# EAGLE schematic tactile (EAGLE 9.6.2)
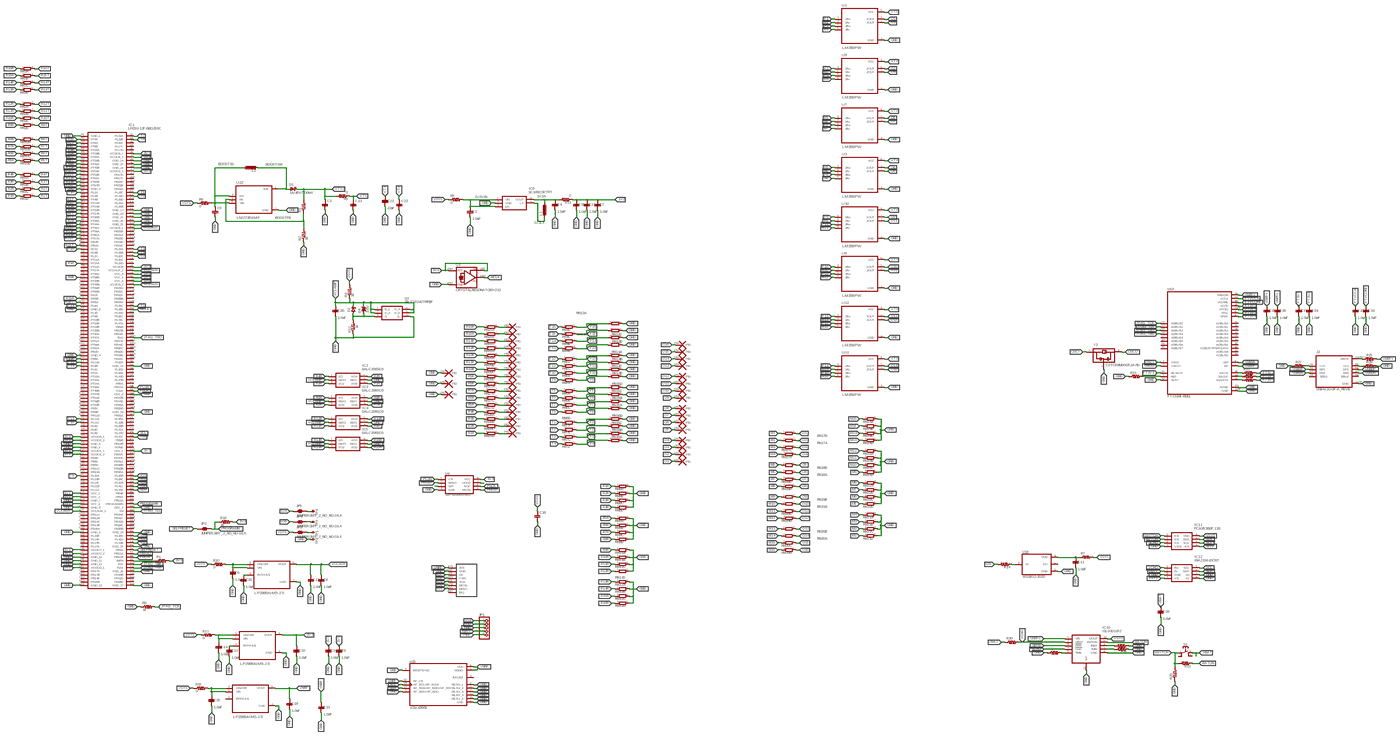
[diagram p0: schematic, sheet 1, overview]
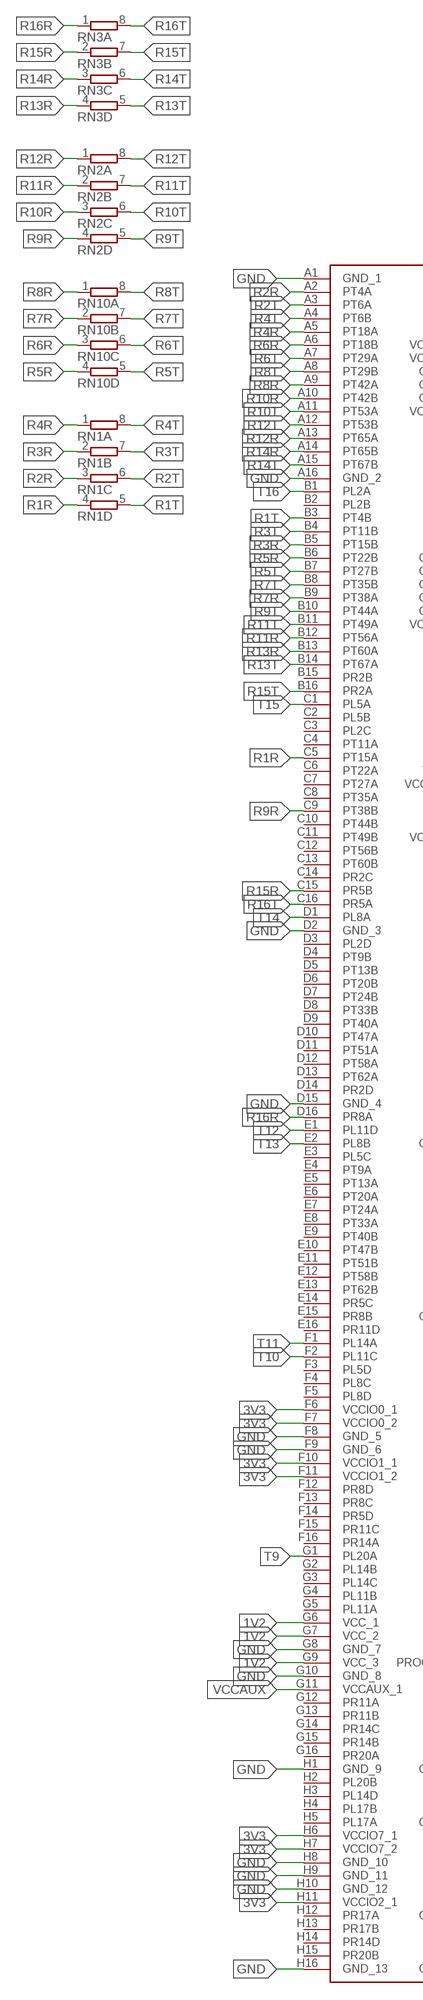
[diagram p1: schematic, sheet 1, part 1 of 4]
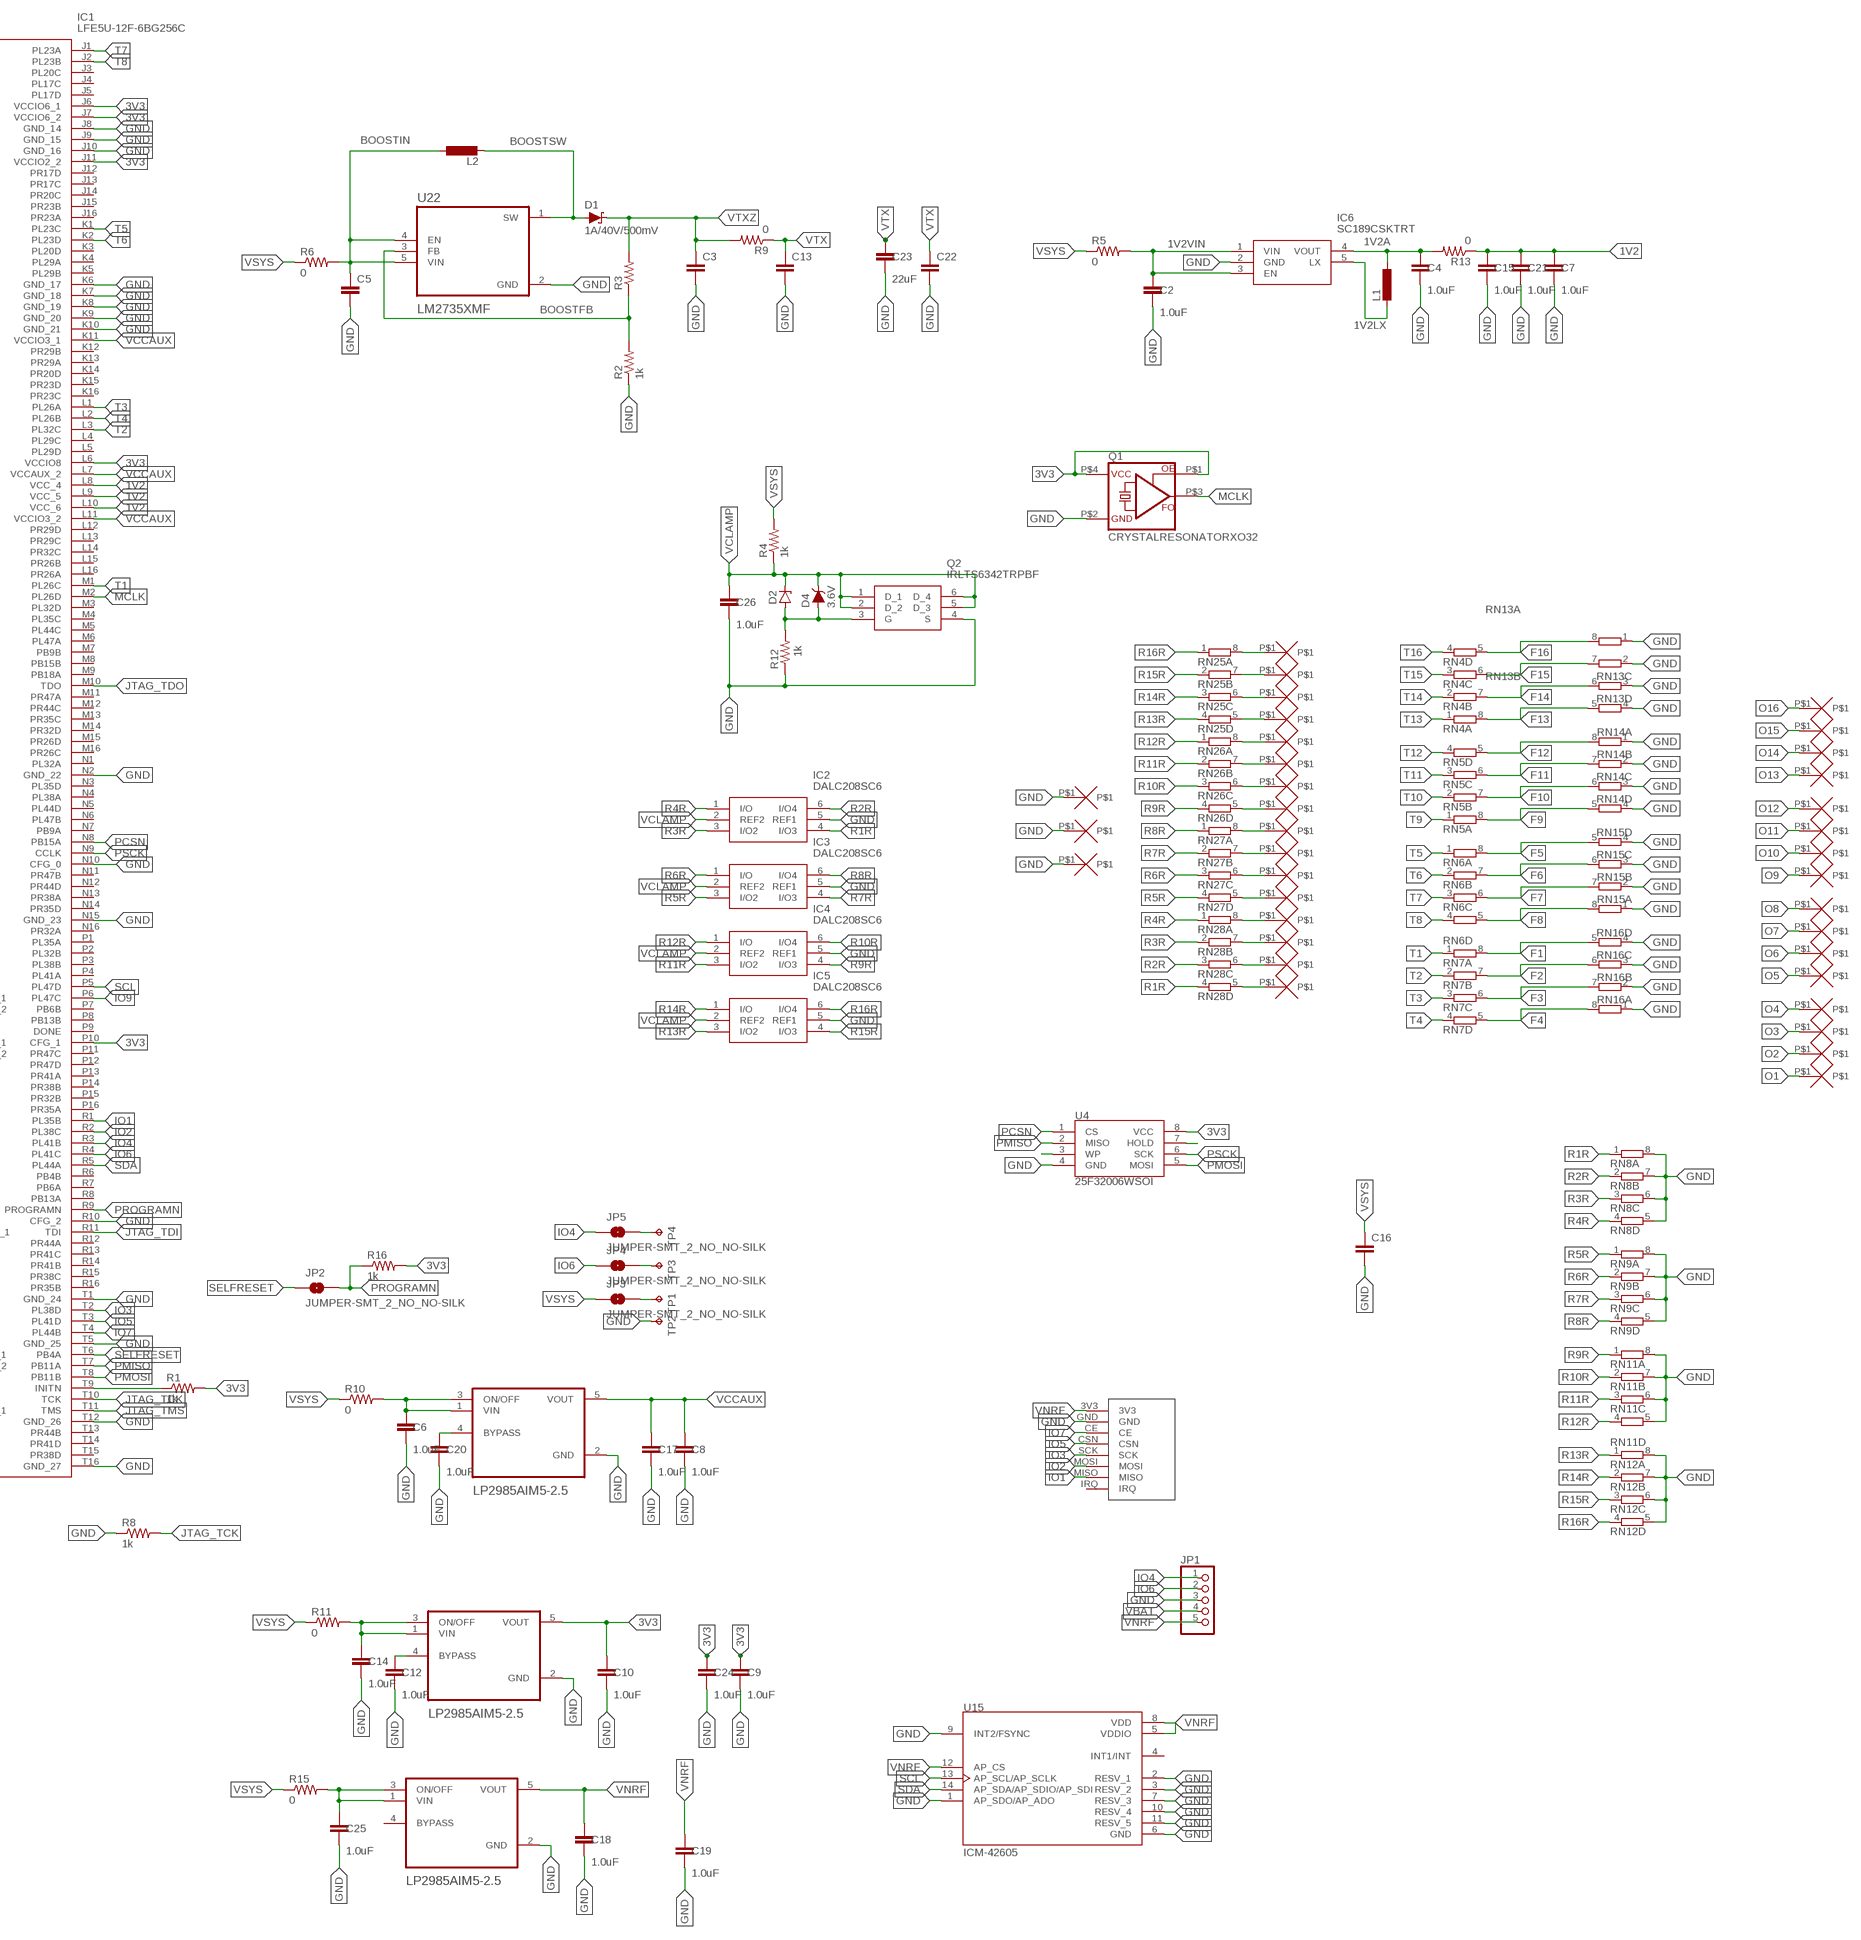
[diagram p2: schematic, sheet 1, part 2 of 4]
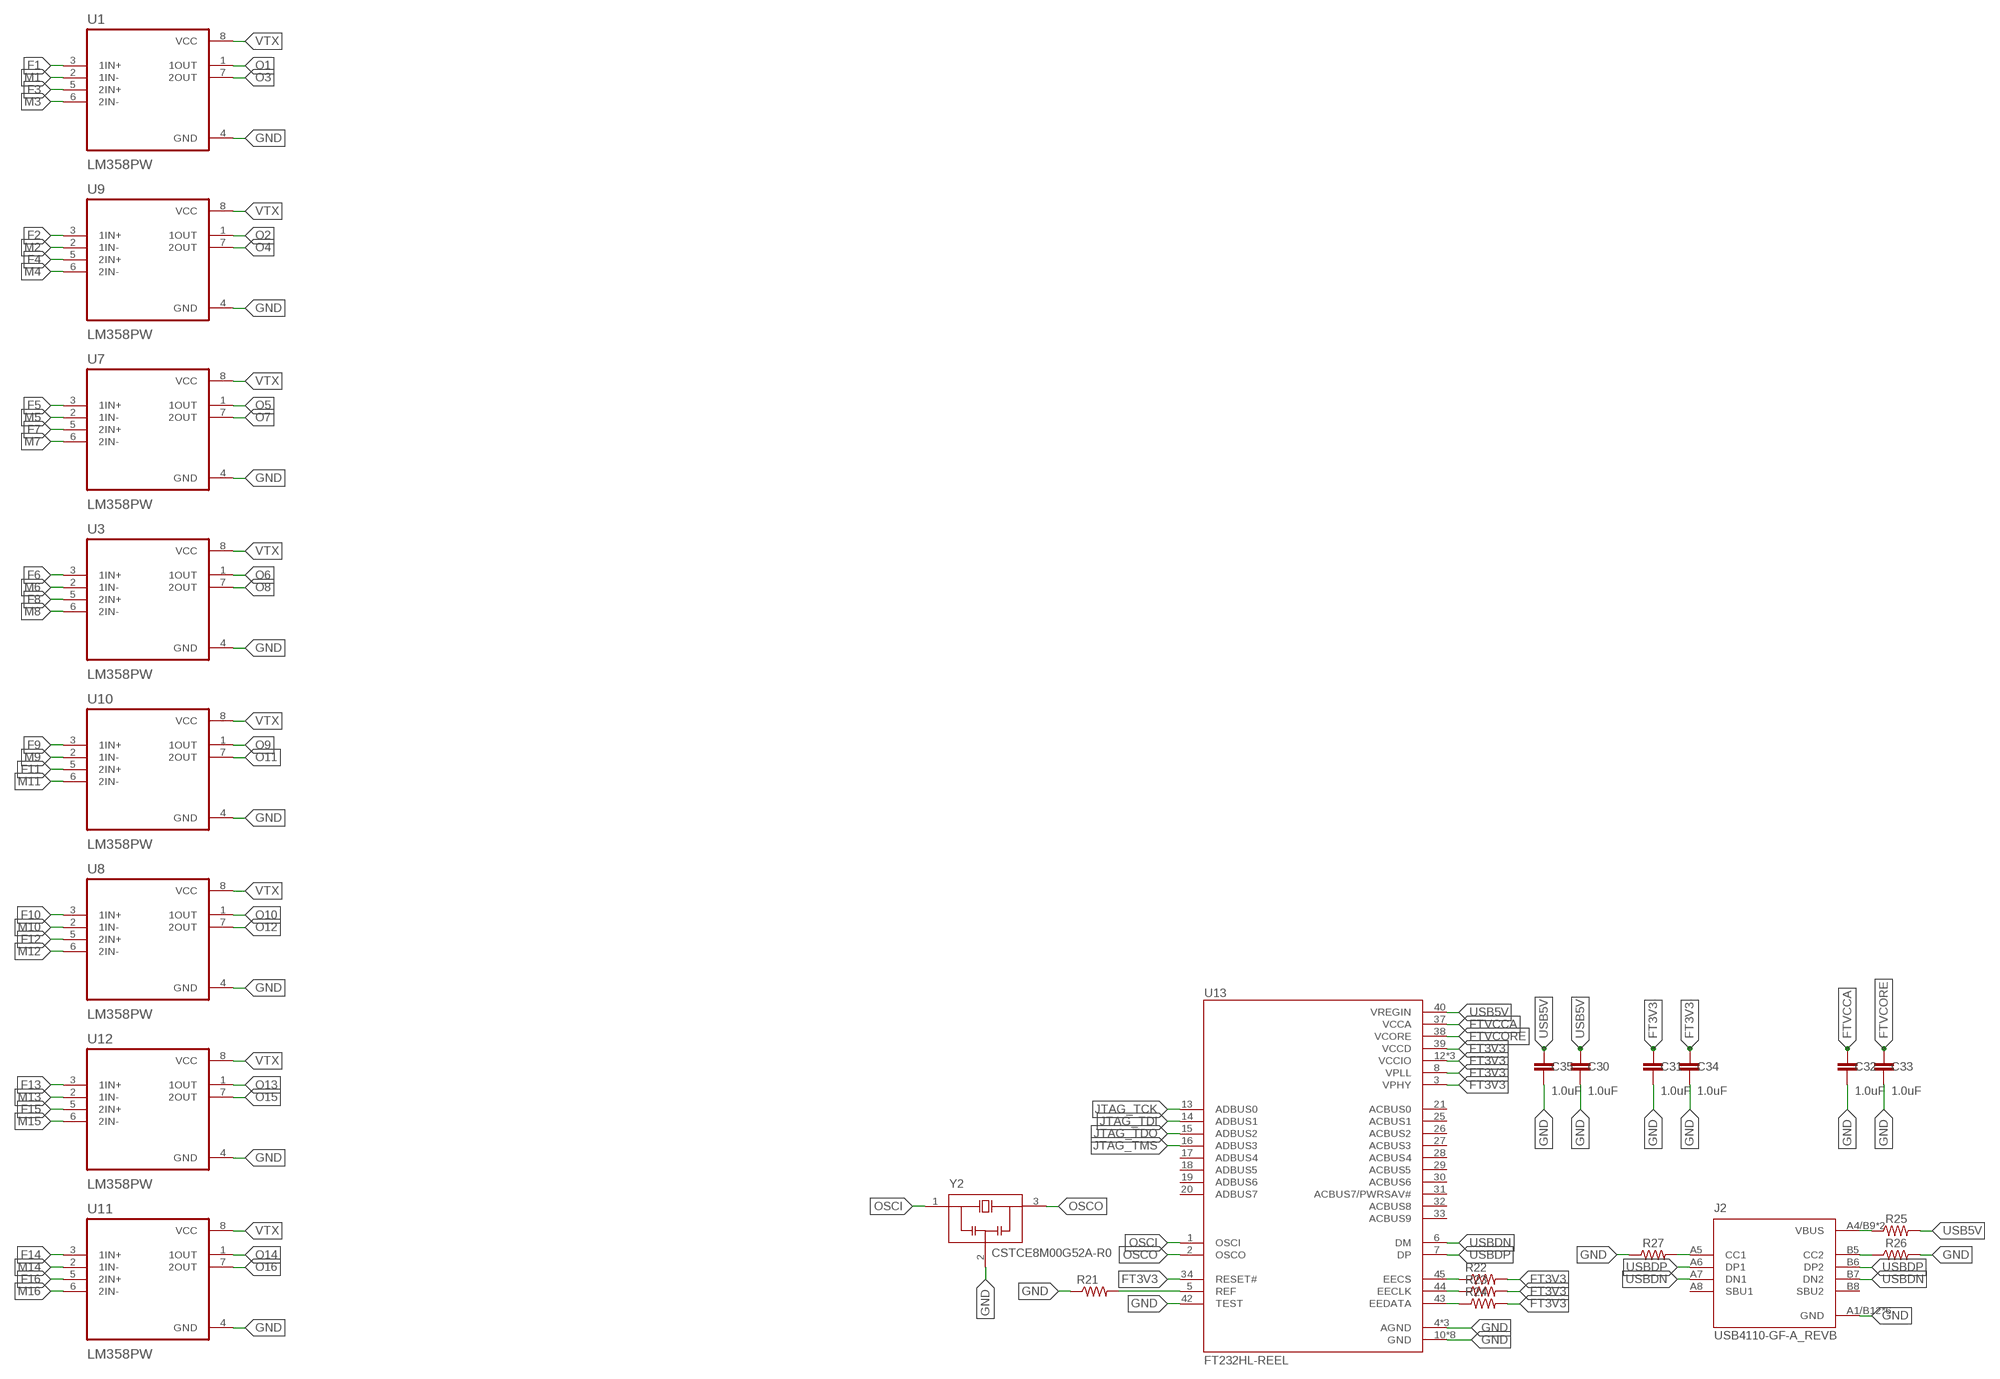
[diagram p3: schematic, sheet 1, part 3 of 4]
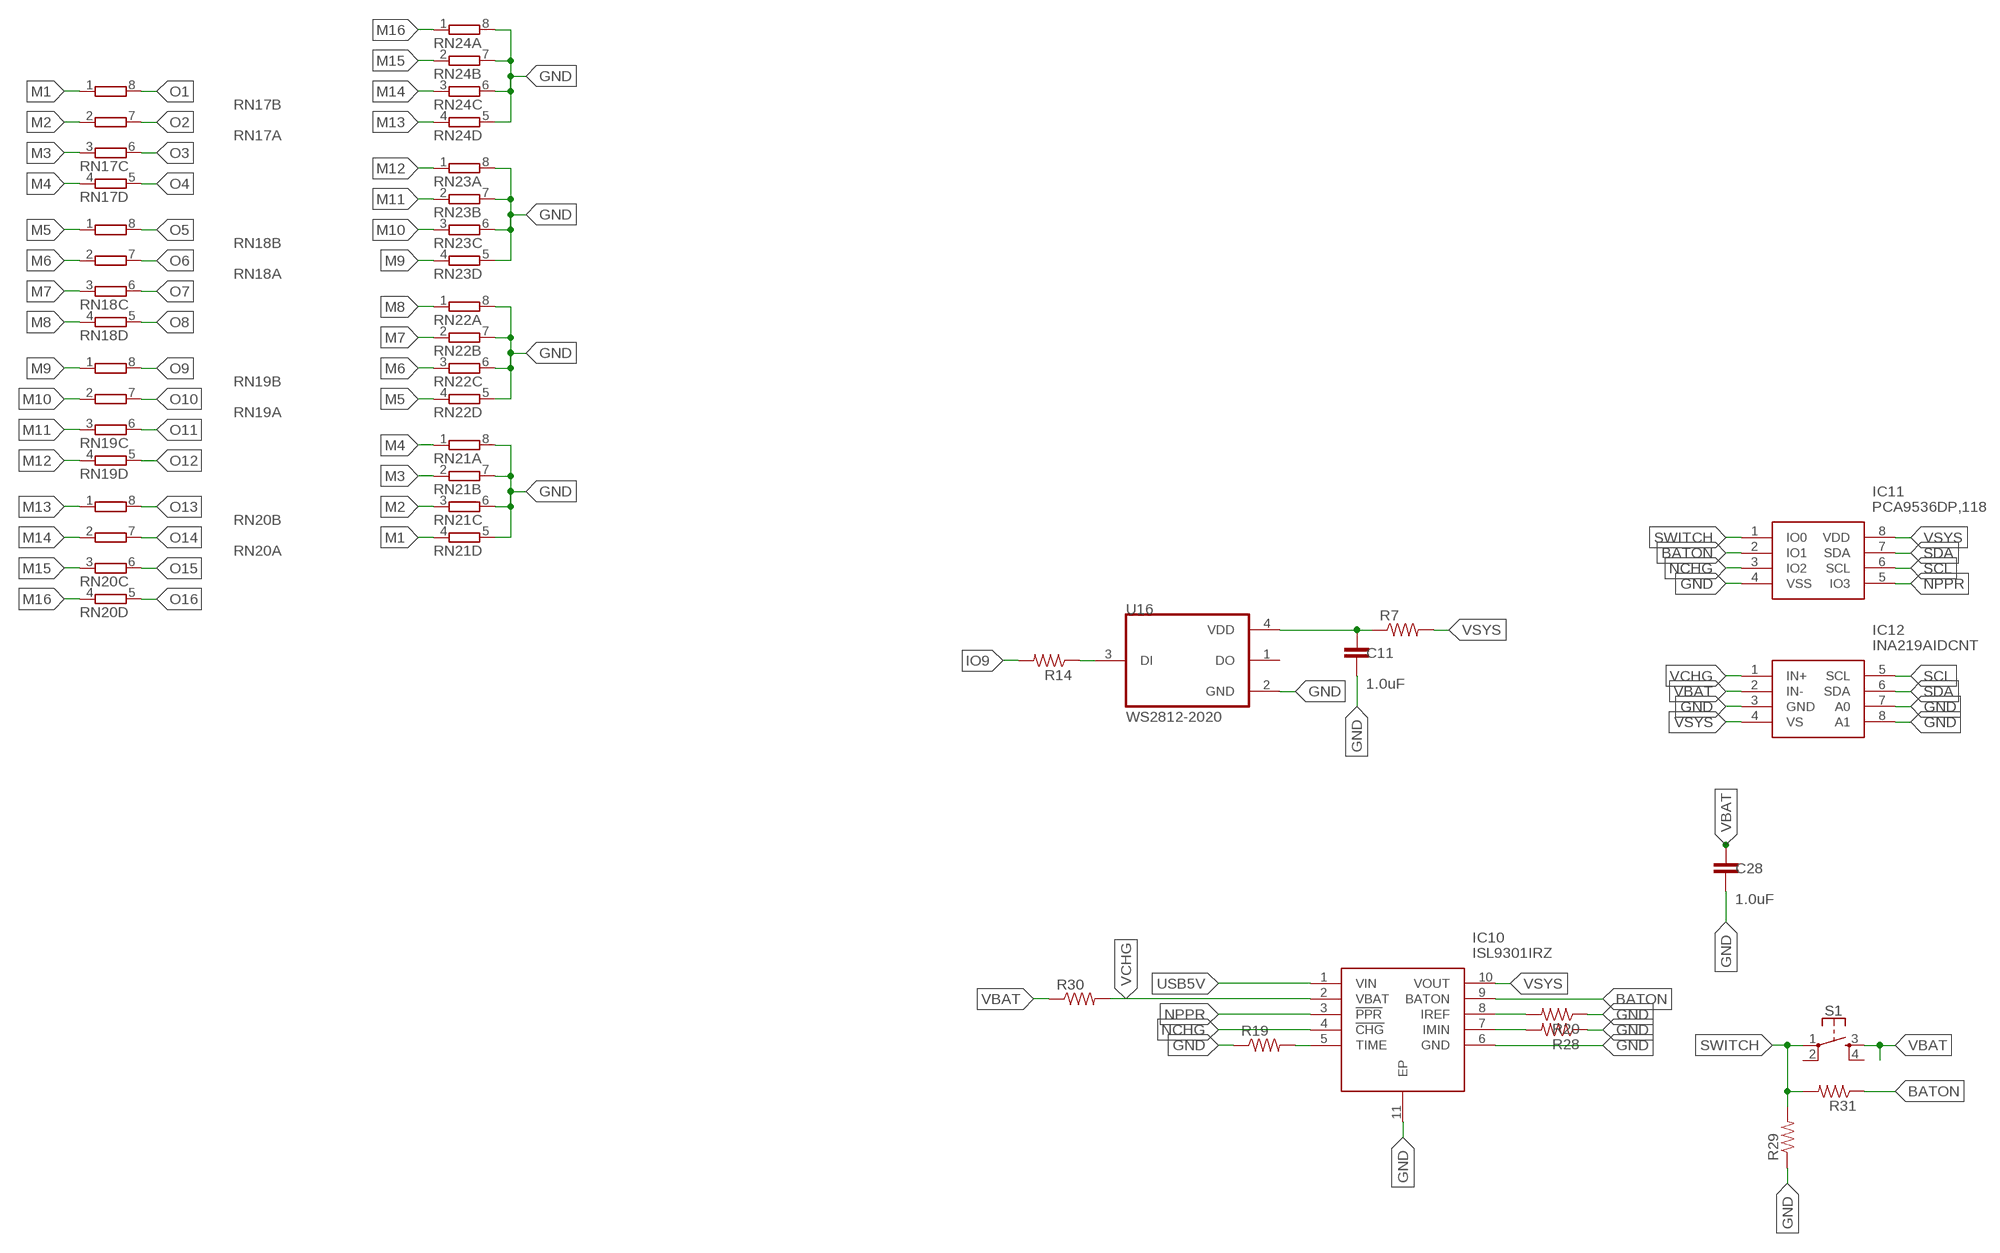
[diagram p4: schematic, sheet 1, part 4 of 4]

## Parts
C2  1.0uF  1.0UF-0603-16V-10%  [0603]
C3  C-EUC0805  [C0805]
C4  1.0uF  1.0UF-0603-16V-10%  [0603]
C5  C-EUC0805  [C0805]
C6  1.0uF  1.0UF-0603-16V-10%  [0603]
C7  1.0uF  1.0UF-0603-16V-10%  [0603]
C8  1.0uF  1.0UF-0603-16V-10%  [0603]
C9  1.0uF  1.0UF-0603-16V-10%  [0603]
C10  1.0uF  1.0UF-0603-16V-10%  [0603]
C11  1.0uF  1.0UF-0603-16V-10%  [0603]
C12  1.0uF  1.0UF-0603-16V-10%  [0603]
C13  C-EUC0805  [C0805]
C14  1.0uF  1.0UF-0603-16V-10%  [0603]
C15  1.0uF  1.0UF-0603-16V-10%  [0603]
C16  C-EUC1812  [C1812]
C17  1.0uF  1.0UF-0603-16V-10%  [0603]
C18  1.0uF  1.0UF-0603-16V-10%  [0603]
C19  1.0uF  1.0UF-0603-16V-10%  [0603]
C20  1.0uF  1.0UF-0603-16V-10%  [0603]
C21  1.0uF  1.0UF-0603-16V-10%  [0603]
C22  C-EUC0805  [C0805]
C23  22uF  22UF-0805-16V-20%  [0805]
C24  1.0uF  1.0UF-0603-16V-10%  [0603]
C25  1.0uF  1.0UF-0603-16V-10%  [0603]
C26  1.0uF  1.0UF-0603-16V-10%  [0603]
C28  1.0uF  1.0UF-0603-16V-10%  [0603]
C30  1.0uF  1.0UF-1206-50V-10%  [1206]
C31  1.0uF  1.0UF-0603-16V-10%  [0603]
C32  1.0uF  1.0UF-0603-16V-10%  [0603]
C33  1.0uF  1.0UF-0603-16V-10%  [0603]
C34  1.0uF  1.0UF-0603-16V-10%  [0603]
C35  1.0uF  1.0UF-0603-16V-10%  [0603]
D1  1A/40V/500mV  DIODE-SCHOTTKY-SS14  [SMA-DIODE]
D2  ZENER-DIODESOT23  [SOT23]
D4  3.6V  DIODE-ZENER-BZT52C3V6S  [SOD-323]
IC1  LFE5U-12F-6BG256C  [BGA256C80P16X16_1400X1400X170]
IC2  DALC208SC6  [SOT95P280X145-6N]
IC3  DALC208SC6  [SOT95P280X145-6N]
IC4  DALC208SC6  [SOT95P280X145-6N]
IC5  DALC208SC6  [SOT95P280X145-6N]
IC6  SC189CSKTRT  [SOT95P280X145-5N]
IC10  ISL9301IRZ  [SON50P300X300X90-11N]
IC11  PCA9536DP,118  [SOP65P490X110-8N]
IC12  INA219AIDCNT  [SOT65P280X145-8N]
J2  USB4110-GF-A_REVB  [GCT_USB4110-GF-A_REVB]
JP1  PINHD-1X5M  [1X05M]
JP2  JUMPER-SMT_2_NO_NO-SILK  [SMT-JUMPER_2_NO_NO-SILK]
JP3  JUMPER-SMT_2_NO_NO-SILK  [SMT-JUMPER_2_NO_NO-SILK]
JP4  JUMPER-SMT_2_NO_NO-SILK  [SMT-JUMPER_2_NO_NO-SILK]
JP5  JUMPER-SMT_2_NO_NO-SILK  [SMT-JUMPER_2_NO_NO-SILK]
L1  L-EUL3230M  [L3230M]
L2  L-EUL3225P  [L3225P]
Q1  CRYSTALRESONATORXO32  [XO32]
Q2  IRLTS6342TRPBF  [SOT95P280X145-6N]
R1  1k  1KOHM-0603-1/10W-1%  [0603]
R2  1k  1KOHM-0603-1/10W-1%  [0603]
R3  1k  1KOHM-0603-1/10W-1%  [0603]
R4  1k  1KOHM-0603-1/10W-1%  [0603]
R5  0  0OHM-0603-1/10W  [0603]
R6  0  0OHM-0603-1/10W  [0603]
R7  RESISTOR0603  [0603]
R8  1k  1KOHM-0603-1/10W-1%  [0603]
R9  0  0OHM-0603-1/10W  [0603]
R10  0  0OHM-0603-1/10W  [0603]
R11  0  0OHM-0603-1/10W  [0603]
R12  1k  1KOHM-0603-1/10W-1%  [0603]
R13  0  0OHM-0603-1/10W  [0603]
R14  RESISTOR0603  [0603]
R15  0  0OHM-0603-1/10W  [0603]
R16  1k  1KOHM-0603-1/10W-1%  [0603]
R19  RESISTOR0603  [0603]
R20  RESISTOR0603  [0603]
R21  RESISTOR0603  [0603]
R22  RESISTOR0603  [0603]
R23  RESISTOR0603  [0603]
R24  RESISTOR0603  [0603]
R25  RESISTOR0603  [0603]
R26  RESISTOR0603  [0603]
R27  RESISTOR0603  [0603]
R28  RESISTOR0603  [0603]
R29  RESISTOR0603  [0603]
R30  RESISTOR0603  [0603]
R31  RESISTOR0603  [0603]
RN1  4R-NEXBV8V  [EXBV8V]
RN2  4R-NEXBV8V  [EXBV8V]
RN3  4R-NEXBV8V  [EXBV8V]
RN4  4R-NEXBV8V  [EXBV8V]
RN5  4R-NEXBV8V  [EXBV8V]
RN6  4R-NEXBV8V  [EXBV8V]
RN7  4R-NEXBV8V  [EXBV8V]
RN8  4R-NEXBV8V  [EXBV8V]
RN9  4R-NEXBV8V  [EXBV8V]
RN10  4R-NEXBV8V  [EXBV8V]
RN11  4R-NEXBV8V  [EXBV8V]
RN12  4R-NEXBV8V  [EXBV8V]
RN13  4R-NEXBV8V  [EXBV8V]
RN14  4R-NEXBV8V  [EXBV8V]
RN15  4R-NEXBV8V  [EXBV8V]
RN16  4R-NEXBV8V  [EXBV8V]
RN17  4R-NEXBV8V  [EXBV8V]
RN18  4R-NEXBV8V  [EXBV8V]
RN19  4R-NEXBV8V  [EXBV8V]
RN20  4R-NEXBV8V  [EXBV8V]
RN21  4R-NEXBV8V  [EXBV8V]
RN22  4R-NEXBV8V  [EXBV8V]
RN23  4R-NEXBV8V  [EXBV8V]
RN24  4R-NEXBV8V  [EXBV8V]
RN25  4R-NEXBV8V  [EXBV8V]
RN26  4R-NEXBV8V  [EXBV8V]
RN27  4R-NEXBV8V  [EXBV8V]
RN28  4R-NEXBV8V  [EXBV8V]
S1  MOMENTARY-SWITCH-SPST-2-SMD-5.2MM  [TACTILE_SWITCH_SMD_5.2MM]
TP1  TPTP12SQ  [TP12SQ]
TP2  TPTP12SQ  [TP12SQ]
TP3  TPTP12SQ  [TP12SQ]
TP4  TPTP12SQ  [TP12SQ]
U1  LM358PW  [SOP65P640X120-8N]
U3  LM358PW  [SOP65P640X120-8N]
U4  25F32006WSOI  SPI_FLASH-X25XXSMD1  [SO08-EIAJ]
U5  LP2985AIM5-2.5  [SOT95P280X145-5N]
U6  LP2985AIM5-2.5  [SOT95P280X145-5N]
U7  LM358PW  [SOP65P640X120-8N]
U8  LM358PW  [SOP65P640X120-8N]
U9  LM358PW  [SOP65P640X120-8N]
U10  LM358PW  [SOP65P640X120-8N]
U11  LM358PW  [SOP65P640X120-8N]
U12  LM358PW  [SOP65P640X120-8N]
U13  FT232HL-REEL  [QFP50P900X900X160-48N]
U14  LP2985AIM5-2.5  [SOT95P280X145-5N]
U15  ICM-42605  [PQFN50P300X250X97-14N]
U16  WS2812-2020  [LED_WS2812-2020]
U22  LM2735XMF  [SOT95P280X145-5N]
U$1  PADPAD3X05  [PAD3X05]
U$2  PADPAD3X05  [PAD3X05]
U$3  PADPAD3X05  [PAD3X05]
U$4  PADPAD3X05  [PAD3X05]
U$5  PADPAD3X05  [PAD3X05]
U$6  PADPAD3X05  [PAD3X05]
U$7  PADPAD3X05  [PAD3X05]
U$8  PADPAD3X05  [PAD3X05]
U$9  NRF24MODULE  [NRF24SMT]
U$10  PADPAD3X05  [PAD3X05]
U$11  PADPAD3X05  [PAD3X05]
U$12  PADPAD3X05  [PAD3X05]
U$13  PADPAD3X05  [PAD3X05]
U$14  PADPAD3X05  [PAD3X05]
U$15  PADPAD3X05  [PAD3X05]
U$16  PADPAD3X05  [PAD3X05]
U$17  PADPAD3X05  [PAD3X05]
U$18  PADPAD3X05  [PAD3X05]
U$19  PADPAD3X05  [PAD3X05]
U$20  PADPAD3X05  [PAD3X05]
U$21  PADPAD3X05  [PAD3X05]
U$22  PADPAD3X05  [PAD3X05]
U$23  PADPAD3X05  [PAD3X05]
U$24  PADPAD3X05  [PAD3X05]
U$25  PADPAD3X05  [PAD3X05]
U$26  PADPAD3X05  [PAD3X05]
U$27  PADPAD3X05  [PAD3X05]
U$28  PADPAD3X05  [PAD3X05]
U$29  PADPAD3X05  [PAD3X05]
U$30  PADPAD3X05  [PAD3X05]
U$31  PADPAD3X05  [PAD3X05]
U$32  PADPAD3X05  [PAD3X05]
U$33  PADPAD3X05  [PAD3X05]
U$34  PADPAD3X05  [PAD3X05]
U$35  PADPAD3X05  [PAD3X05]
U$36  PADPAD3X05  [PAD3X05]
Y2  CSTCE8M00G52A-R0  [OSC_CSTCE8M00G52A-R0]

## Nets
1V2: C7.1 C15.1 C21.1 IC1.G6(VCC_1) IC1.G7(VCC_2) IC1.G9(VCC_3) IC1.L8(VCC_4) IC1.L9(VCC_5) IC1.L10(VCC_6) R13.1
1V2A: C4.1 IC6.4(VOUT) L1.1 R13.2
1V2LX: IC6.5(LX) L1.2
1V2VIN: C2.1 IC6.1(VIN) IC6.3(EN) R5.2
3V3: C9.1 C10.1 C24.1 IC1.F6(VCCIO0_1) IC1.F7(VCCIO0_2) IC1.F10(VCCIO1_1) IC1.F11(VCCIO1_2) IC1.H6(VCCIO7_1) IC1.H7(VCCIO7_2) IC1.H11(VCCIO2_1) IC1.J6(VCCIO6_1) IC1.J7(VCCIO6_2) IC1.J11(VCCIO2_2) IC1.L6(VCCIO8) IC1.P10(CFG_1) Q1.P$1(OE) Q1.P$4(VCC) R1.2 R16.2 U4.8(VCC) U6.5(VOUT)
BATON: IC10.9(BATON) IC11.2(IO1) R31.1
BOOSTFB: R2.2 R3.1 U22.3(FB)
BOOSTIN: C5.1 L2.1 R6.2 U22.4(EN) U22.5(VIN)
BOOSTSW: D1.A L2.2 U22.1(SW)
F1: RN7.8 RN16.5 U1.3(1IN+)
F2: RN7.7 RN16.6 U9.3(1IN+)
F3: RN7.6 RN16.7 U1.5(2IN+)
F4: RN7.5 RN16.8 U9.5(2IN+)
F5: RN6.8 RN15.5 U7.3(1IN+)
F6: RN6.7 RN15.6 U3.3(1IN+)
F7: RN6.6 RN15.7 U7.5(2IN+)
F8: RN6.5 RN15.8 U3.5(2IN+)
F9: RN5.8 RN14.5 U10.3(1IN+)
F10: RN5.7 RN14.6 U8.3(1IN+)
F11: RN5.6 RN14.7 U10.5(2IN+)
F12: RN5.5 RN14.8 U8.5(2IN+)
F13: RN4.8 RN13.5 U12.3(1IN+)
F14: RN4.7 RN13.6 U11.3(1IN+)
F15: RN4.6 RN13.7 U12.5(2IN+)
F16: RN4.5 RN13.8 U11.5(2IN+)
FT3V3: C31.1 C34.1 R22.2 R23.2 R24.2 U13.3(VPHY) U13.8(VPLL) U13.12(VCCIO) U13.24(VCCIO) U13.34(RESET#) U13.39(VCCD) U13.46(VCCIO)
FTVCCA: C32.1 U13.37(VCCA)
FTVCORE: C33.1 U13.38(VCORE)
GND: C2.2 C3.2 C4.2 C5.2 C6.2 C7.2 C8.2 C9.2 C10.2 C11.2 C12.2 C13.2 C14.2 C15.2 C16.2 C17.2 C18.2 C19.2 C20.2 C21.2 C22.2 C23.2 C24.2 C25.2 C26.2 C28.2 C30.2 C31.2 C32.2 C33.2 C34.2 C35.2 IC1.A1(GND_1) IC1.A16(GND_2) IC1.D2(GND_3) IC1.D15(GND_4) IC1.F8(GND_5) IC1.F9(GND_6) IC1.G8(GND_7) IC1.G10(GND_8) IC1.H1(GND_9) IC1.H8(GND_10) IC1.H9(GND_11) IC1.H10(GND_12) IC1.H16(GND_13) IC1.J8(GND_14) IC1.J9(GND_15) IC1.J10(GND_16) IC1.K6(GND_17) IC1.K7(GND_18) IC1.K8(GND_19) IC1.K9(GND_20) IC1.K10(GND_21) IC1.N2(GND_22) IC1.N10(CFG_0) IC1.N15(GND_23) IC1.R10(CFG_2) IC1.T1(GND_24) IC1.T5(GND_25) IC1.T12(GND_26) IC1.T16(GND_27) IC2.5(REF1) IC3.5(REF1) IC4.5(REF1) IC5.5(REF1) IC6.2(GND) IC10.6(GND) IC10.11(EP) IC11.4(VSS) IC12.3(GND) IC12.7(A0) IC12.8(A1) J2.A1/B12(GND) J2.B1/A12(GND) J2.S1(GND) J2.S2(GND) J2.S3(GND) J2.S4(GND) JP1.3 Q1.P$2(GND) Q2.4(S) R2.1 R8.1 R12.1 R19.1 R20.1 R21.1 R26.2 R27.1 R28.1 R29.1 RN8.5 RN8.6 RN8.7 RN8.8 RN9.5 RN9.6 RN9.7 RN9.8 RN11.5 RN11.6 RN11.7 RN11.8 RN12.5 RN12.6 RN12.7 RN12.8 RN13.1 RN13.2 RN13.3 RN13.4 RN14.1 RN14.2 RN14.3 RN14.4 RN15.1 RN15.2 RN15.3 RN15.4 RN16.1 RN16.2 RN16.3 RN16.4 RN21.5 RN21.6 RN21.7 RN21.8 RN22.5 RN22.6 RN22.7 RN22.8 RN23.5 RN23.6 RN23.7 RN23.8 RN24.5 RN24.6 RN24.7 RN24.8 TP2.TP U1.4(GND) U3.4(GND) U4.4(GND) U5.2(GND) U6.2(GND) U7.4(GND) U8.4(GND) U9.4(GND) U10.4(GND) U11.4(GND) U12.4(GND) U13.4(AGND) U13.9(AGND) U13.10(GND) U13.11(GND) U13.22(GND) U13.23(GND) U13.35(GND) U13.36(GND) U13.41(AGND) U13.42(TEST) U13.47(GND) U13.48(GND) U14.2(GND) U15.1(AP_SDO/AP_ADO) U15.2(RESV_1) U15.3(RESV_2) U15.6(GND) U15.7(RESV_3) U15.9(INT2/FSYNC) U15.10(RESV_4) U15.11(RESV_5) U16.2(GND) U22.2(GND) U$1.P$1 U$9.GND U$35.P$1 U$36.P$1 Y2.2(GND)
IO1: IC1.R1(PL35B) U$9.MISO
IO2: IC1.R2(PL38C) U$9.MOSI
IO3: IC1.T2(PL38D) U$9.SCK
IO4: IC1.R3(PL41B) JP1.1 JP5.1
IO5: IC1.T3(PL41D) U$9.CSN
IO6: IC1.R4(PL41C) JP1.2 JP4.1
IO7: IC1.T4(PL44B) U$9.CE
IO9: IC1.P6(PL47C) R14.2
JTAG_TCK: IC1.T10(TCK) R8.2 U13.13(ADBUS0)
JTAG_TDI: IC1.R11(TDI) U13.14(ADBUS1)
JTAG_TDO: IC1.M10(TDO) U13.15(ADBUS2)
JTAG_TMS: IC1.T11(TMS) U13.16(ADBUS3)
M1: RN17.1 RN21.4 U1.2(1IN-)
M2: RN17.2 RN21.3 U9.2(1IN-)
M3: RN17.3 RN21.2 U1.6(2IN-)
M4: RN17.4 RN21.1 U9.6(2IN-)
M5: RN18.1 RN22.4 U7.2(1IN-)
M6: RN18.2 RN22.3 U3.2(1IN-)
M7: RN18.3 RN22.2 U7.6(2IN-)
M8: RN18.4 RN22.1 U3.6(2IN-)
M9: RN19.1 RN23.4 U10.2(1IN-)
M10: RN19.2 RN23.3 U8.2(1IN-)
M11: RN19.3 RN23.2 U10.6(2IN-)
M12: RN19.4 RN23.1 U8.6(2IN-)
M13: RN20.1 RN24.4 U12.2(1IN-)
M14: RN20.2 RN24.3 U11.2(1IN-)
M15: RN20.3 RN24.2 U12.6(2IN-)
M16: RN20.4 RN24.1 U11.6(2IN-)
MCLK: IC1.M2(PL26D) Q1.P$3(FO)
N$1: RN25.8 U$18.P$1
N$2: IC10.5(TIME) R19.2
N$3: IC10.8(IREF) R20.2
N$4: IC1.T9(INITN) R1.1
N$5: RN25.7 U$17.P$1
N$6: RN25.6 U$16.P$1
N$7: RN25.5 U$15.P$1
N$8: RN26.5 U$11.P$1
N$9: RN26.6 U$12.P$1
N$10: RN26.7 U$13.P$1
N$11: RN26.8 U$14.P$1
N$12: RN27.5 U$6.P$1
N$13: RN27.6 U$7.P$1
N$14: RN27.7 U$8.P$1
N$15: RN27.8 U$10.P$1
N$16: RN28.5 U$2.P$1
N$17: RN28.6 U$3.P$1
N$18: RN28.7 U$4.P$1
N$19: RN28.8 U$5.P$1
N$20: U4.3(WP)
N$21: U4.7(HOLD)
N$22: C12.1 U6.4(BYPASS)
N$23: IC10.7(IMIN) R28.2
N$24: C11.1 R7.1 U16.4(VDD)
N$25: R14.1 U16.3(DI)
N$26: D2.1(A) D4.A Q2.3(G) R12.2
N$27: C20.1 U5.4(BYPASS)
N$28: C6.1 R10.2 U5.1(VIN) U5.3(ON/OFF)
N$29: JP3.2 TP1.TP
N$30: C14.1 R11.2 U6.1(VIN) U6.3(ON/OFF)
N$31: C25.1 R15.2 U14.1(VIN) U14.3(ON/OFF)
N$32: JP4.2 TP3.TP
N$33: JP5.2 TP4.TP
N$41: R21.2 U13.5(REF)
N$42: R22.1 U13.45(EECS)
N$43: R23.1 U13.44(EECLK)
N$44: R24.1 U13.43(EEDATA)
N$45: J2.A5(CC1) R27.2
N$46: J2.B5(CC2) R26.1
N$47: J2.A4/B9(VBUS) J2.B4/A9(VBUS) R25.1
NCHG: IC10.4(!CHG) IC11.3(IO2)
NPPR: IC10.3(!PPR) IC11.5(IO3)
O1: RN17.8 U1.1(1OUT) U$20.P$1
O2: RN17.7 U9.1(1OUT) U$21.P$1
O3: RN17.6 U1.7(2OUT) U$19.P$1
O4: RN17.5 U9.7(2OUT) U$22.P$1
O5: RN18.8 U7.1(1OUT) U$23.P$1
O6: RN18.7 U3.1(1OUT) U$24.P$1
O7: RN18.6 U7.7(2OUT) U$25.P$1
O8: RN18.5 U3.7(2OUT) U$26.P$1
O9: RN19.8 U10.1(1OUT) U$27.P$1
O10: RN19.7 U8.1(1OUT) U$28.P$1
O11: RN19.6 U10.7(2OUT) U$29.P$1
O12: RN19.5 U8.7(2OUT) U$30.P$1
O13: RN20.8 U12.1(1OUT) U$31.P$1
O14: RN20.7 U11.1(1OUT) U$32.P$1
O15: RN20.6 U12.7(2OUT) U$33.P$1
O16: RN20.5 U11.7(2OUT) U$34.P$1
OSCI: U13.1(OSCI) Y2.1(IN)
OSCO: U13.2(OSCO) Y2.3(OUT)
PCSN: IC1.N8(PB15A) U4.1(CS)
PMISO: IC1.T7(PB11A) U4.2(MISO)
PMOSI: IC1.T8(PB11B) U4.5(MOSI)
PROGRAMN: IC1.R9(PROGRAMN) JP2.2 R16.1
PSCK: IC1.N9(CCLK) U4.6(SCK)
R1R: IC1.C5(PT15A) IC2.4(I/O3) RN1.4 RN8.1 RN28.4
R1T: IC1.B3(PT4B) RN1.5
R2R: IC1.A2(PT4A) IC2.6(I/O4) RN1.3 RN8.2 RN28.3
R2T: IC1.A3(PT6A) RN1.6
R3R: IC1.B5(PT15B) IC2.3(I/O2) RN1.2 RN8.3 RN28.2
R3T: IC1.B4(PT11B) RN1.7
R4R: IC1.A5(PT18A) IC2.1(I/O) RN1.1 RN8.4 RN28.1
R4T: IC1.A4(PT6B) RN1.8
R5R: IC1.B6(PT22B) IC3.3(I/O2) RN9.1 RN10.4 RN27.4
R5T: IC1.B7(PT27B) RN10.5
R6R: IC1.A6(PT18B) IC3.1(I/O) RN9.2 RN10.3 RN27.3
R6T: IC1.A7(PT29A) RN10.6
R7R: IC1.B9(PT38A) IC3.4(I/O3) RN9.3 RN10.2 RN27.2
R7T: IC1.B8(PT35B) RN10.7
R8R: IC1.A9(PT42A) IC3.6(I/O4) RN9.4 RN10.1 RN27.1
R8T: IC1.A8(PT29B) RN10.8
R9R: IC1.C9(PT38B) IC4.4(I/O3) RN2.4 RN11.1 RN26.4
R9T: IC1.B10(PT44A) RN2.5
R10R: IC1.A10(PT42B) IC4.6(I/O4) RN2.3 RN11.2 RN26.3
R10T: IC1.A11(PT53A) RN2.6
R11R: IC1.B12(PT56A) IC4.3(I/O2) RN2.2 RN11.3 RN26.2
R11T: IC1.B11(PT49A) RN2.7
R12R: IC1.A13(PT65A) IC4.1(I/O) RN2.1 RN11.4 RN26.1
R12T: IC1.A12(PT53B) RN2.8
R13R: IC1.B13(PT60A) IC5.3(I/O2) RN3.4 RN12.1 RN25.4
R13T: IC1.B14(PT67A) RN3.5
R14R: IC1.A14(PT65B) IC5.1(I/O) RN3.3 RN12.2 RN25.3
R14T: IC1.A15(PT67B) RN3.6
R15R: IC1.C15(PR5B) IC5.4(I/O3) RN3.2 RN12.3 RN25.2
R15T: IC1.B16(PR2A) RN3.7
R16R: IC1.D16(PR8A) IC5.6(I/O4) RN3.1 RN12.4 RN25.1
R16T: IC1.C16(PR5A) RN3.8
SCL: IC1.P5(PL47D) IC11.6(SCL) IC12.5(SCL) U15.13(AP_SCL/AP_SCLK)
SDA: IC1.R5(PL44A) IC11.7(SDA) IC12.6(SDA) U15.14(AP_SDA/AP_SDIO/AP_SDI)
SELFRESET: IC1.T6(PB4A) JP2.1
SWITCH: IC11.1(IO0) R29.2 R31.2 S1.1
T1: IC1.M1(PL26C) RN7.1
T2: IC1.L3(PL32C) RN7.2
T3: IC1.L1(PL26A) RN7.3
T4: IC1.L2(PL26B) RN7.4
T5: IC1.K1(PL23C) RN6.1
T6: IC1.K2(PL23D) RN6.2
T7: IC1.J1(PL23A) RN6.3
T8: IC1.J2(PL23B) RN6.4
T9: IC1.G1(PL20A) RN5.1
T10: IC1.F2(PL11C) RN5.2
T11: IC1.F1(PL14A) RN5.3
T12: IC1.E1(PL11D) RN5.4
T13: IC1.E2(PL8B) RN4.1
T14: IC1.D1(PL8A) RN4.2
T15: IC1.C1(PL5A) RN4.3
T16: IC1.B1(PL2A) RN4.4
USB5V: C30.1 C35.1 IC10.1(VIN) R25.2 U13.40(VREGIN)
USBDN: J2.A7(DN1) J2.B7(DN2) U13.6(DM)
USBDP: J2.A6(DP1) J2.B6(DP2) U13.7(DP)
VBAT: C28.1 IC12.2(IN-) JP1.4 R30.1 S1.3
VCCAUX: C8.1 C17.1 IC1.G11(VCCAUX_1) IC1.K11(VCCIO3_1) IC1.L7(VCCAUX_2) IC1.L11(VCCIO3_2) U5.5(VOUT)
VCHG: IC10.2(VBAT) IC12.1(IN+) R30.2
VCLAMP: C26.1 D2.3(C) D4.C IC2.2(REF2) IC3.2(REF2) IC4.2(REF2) IC5.2(REF2) Q2.1(D_1) Q2.2(D_2) Q2.5(D_3) Q2.6(D_4) R4.1
VNRF: C18.1 C19.1 JP1.5 U14.5(VOUT) U15.5(VDDIO) U15.8(VDD) U15.12(AP_CS) U$9.3V3
VSYS: C16.1 IC10.10(VOUT) IC11.8(VDD) IC12.4(VS) JP3.1 R4.2 R5.1 R6.1 R7.2 R10.1 R11.1 R15.1
VTX: C13.1 C22.1 C23.1 R9.1 U1.8(VCC) U3.8(VCC) U7.8(VCC) U8.8(VCC) U9.8(VCC) U10.8(VCC) U11.8(VCC) U12.8(VCC)
VTXZ: C3.1 D1.C R3.2 R9.2
Unconnected: IC1.B2(PL2B) IC1.B15(PR2B) IC1.C2(PL5B) IC1.C3(PL2C) IC1.C4(PT11A) IC1.C6(PT22A) IC1.C7(PT27A) IC1.C8(PT35A) IC1.C10(PT44B) IC1.C11(PT49B) IC1.C12(PT56B) IC1.C13(PT60B) IC1.C14(PR2C) IC1.D3(PL2D) IC1.D4(PT9B) IC1.D5(PT13B) IC1.D6(PT20B) IC1.D7(PT24B) IC1.D8(PT33B) IC1.D9(PT40A) IC1.D10(PT47A) IC1.D11(PT51A) IC1.D12(PT58A) IC1.D13(PT62A) IC1.D14(PR2D) IC1.E3(PL5C) IC1.E4(PT9A) IC1.E5(PT13A) IC1.E6(PT20A) IC1.E7(PT24A) IC1.E8(PT33A) IC1.E9(PT40B) IC1.E10(PT47B) IC1.E11(PT51B) IC1.E12(PT58B) IC1.E13(PT62B) IC1.E14(PR5C) IC1.E15(PR8B) IC1.E16(PR11D) IC1.F3(PL5D) IC1.F4(PL8C) IC1.F5(PL8D) IC1.F12(PR8D) IC1.F13(PR8C) IC1.F14(PR5D) IC1.F15(PR11C) IC1.F16(PR14A) IC1.G2(PL14B) IC1.G3(PL14C) IC1.G4(PL11B) IC1.G5(PL11A) IC1.G12(PR11A) IC1.G13(PR11B) IC1.G14(PR14C) IC1.G15(PR14B) IC1.G16(PR20A) IC1.H2(PL20B) IC1.H3(PL14D) IC1.H4(PL17B) IC1.H5(PL17A) IC1.H12(PR17A) IC1.H13(PR17B) IC1.H14(PR14D) IC1.H15(PR20B) IC1.J3(PL20C) IC1.J4(PL17C) IC1.J5(PL17D) IC1.J12(PR17D) IC1.J13(PR17C) IC1.J14(PR20C) IC1.J15(PR23B) IC1.J16(PR23A) IC1.K3(PL20D) IC1.K4(PL29A) IC1.K5(PL29B) IC1.K12(PR29B) IC1.K13(PR29A) IC1.K14(PR20D) IC1.K15(PR23D) IC1.K16(PR23C) IC1.L4(PL29C) IC1.L5(PL29D) IC1.L12(PR29D) IC1.L13(PR29C) IC1.L14(PR32C) IC1.L15(PR26B) IC1.L16(PR26A) IC1.M3(PL32D) IC1.M4(PL35C) IC1.M5(PL44C) IC1.M6(PL47A) IC1.M7(PB9B) IC1.M8(PB15B) IC1.M9(PB18A) IC1.M11(PR47A) IC1.M12(PR44C) IC1.M13(PR35C) IC1.M14(PR32D) IC1.M15(PR26D) IC1.M16(PR26C) IC1.N1(PL32A) IC1.N3(PL35D) IC1.N4(PL38A) IC1.N5(PL44D) IC1.N6(PL47B) IC1.N7(PB9A) IC1.N11(PR47B) IC1.N12(PR44D) IC1.N13(PR38A) IC1.N14(PR35D) IC1.N16(PR32A) IC1.P1(PL35A) IC1.P2(PL32B) IC1.P3(PL38B) IC1.P4(PL41A) IC1.P7(PB6B) IC1.P8(PB13B) IC1.P9(DONE) IC1.P11(PR47C) IC1.P12(PR47D) IC1.P13(PR41A) IC1.P14(PR38B) IC1.P15(PR32B) IC1.P16(PR35A) IC1.R6(PB4B) IC1.R7(PB6A) IC1.R8(PB13A) IC1.R12(PR44A) IC1.R13(PR41C) IC1.R14(PR41B) IC1.R15(PR38C) IC1.R16(PR35B) IC1.T13(PR44B) IC1.T14(PR41D) IC1.T15(PR38D) J2.A8(SBU1) J2.B8(SBU2) S1.2 S1.4 U13.17(ADBUS4) U13.18(ADBUS5) U13.19(ADBUS6) U13.20(ADBUS7) U13.21(ACBUS0) U13.25(ACBUS1) U13.26(ACBUS2) U13.27(ACBUS3) U13.28(ACBUS4) U13.29(ACBUS5) U13.30(ACBUS6) U13.31(ACBUS7/PWRSAV#) U13.32(ACBUS8) U13.33(ACBUS9) U14.4(BYPASS) U15.4(INT1/INT) U16.1(DO) U$9.IRQ

## Library data of the parts
C2 C4 C6-C12 C14 C15 C17-C21 C24-C26 C28 C31-C35 = SparkFun-Capacitors:1.0UF: 1µF ceramic capacitors A capacitor is a passive two-terminal electrical component used to store electrical energy temporarily in an electric field.; PROD_ID: CAP-00868
C3 C5 C13 C16 C22 = resistor:C-EU: CAPACITOR, European symbol
C23 = SparkFun-Capacitors:22UF: 22µF ceramic capacitors A capacitor is a passive two-terminal electrical component used to store electrical energy temporarily in an electric field.; PROD_ID: CAP-14260
C30 = SparkFun-Capacitors:1.0UF: 1µF ceramic capacitors A capacitor is a passive two-terminal electrical component used to store electrical energy temporarily in an electric field.; PROD_ID: CAP-09822
D1 = SparkFun-DiscreteSemi:DIODE-SCHOTTKY: Schottky diode A Schottky diode is a semiconductor diode which has a low forward voltage drop and a very fast switching action.; PROD_ID: DIO-08053
D2 = diode:ZENER-DIODE: Z-Diode
D4 = SparkFun-DiscreteSemi:DIODE-ZENER: Zener Diode A Zener diode allows current to flow from its anode to its cathode like a normal semiconductor diode, but it also permits current to flow in the reverse direction when its "Zener voltage" is reached. - WIkipedia; PROD_ID: DIO-08199
IC1 = LFE5U-12F-6BG256C:LFE5U-12F-6BG256C: FPGA - Field Programmable Gate Array ECP5; 12k LUTs; 1.1V Source: Datasheet <http://www.latticesemi.com/-/media/LatticeSemi/Documents/DataSheets/ECP5/FPGA-DS-02012-1-9-ECP5-ECP5G-Family-Data-Sheet.ashx?document_id=50461> Check prices <https://pricing.snapeda.com/parts/LFE5U-12F-6BG256C/Lattice%20Semiconductor/view-part?ref=eda>; AVAILABILITY: Warning; DESCRIPTION: ECP5 Field Programmable Gate Array (FPGA) IC 197 589824 12000 256-LFBGA; MF: Lattice Semiconductor; MP: LFE5U-12F-6BG256C; PACKAGE: CABGA-256 Lattice Semiconductor; PRICE: None; PURCHASE-URL: https://pricing.snapeda.com/search/part/LFE5U-12F-6BG256C/?ref=eda
IC2-IC5 = DALC208SC6 (1):DALC208SC6: TVS Diode Array DALC208SC6 Octal, SOT-23 6-Pin Source: Datasheet <http://docs-emea.rs-online.com/webdocs/096d/0900766b8096d187.pdf> Check availability <https://pricing.snapeda.com/parts/DALC208SC6/STMicroelectronics/view-part?ref=eda>; AVAILABILITY: In Stock; DESCRIPTION: - Clamp - Ipp Tvs Diode Surface Mount SOT-23-6; MF: STMicroelectronics; MP: DALC208SC6; PACKAGE: SOT-23-6 STMicroelectronics; PRICE: None; PURCHASE-URL: https://pricing.snapeda.com/search/part/DALC208SC6/?ref=eda
IC6 = SC189CSKTRT:SC189CSKTRT: Conv DC-DC 2.9V to 5.5V Synchronous Step Down Single-Out 1.2V 1.5A 6-Pin MLPD-UT T/R Source: Datasheet <https://datasheet.datasheetarchive.com/originals/distributors/Datasheets-DGA14/1272982.pdf>; ARROW_PART_NUMBER: SC189CSKTRT; ARROW_PRICE-STOCK: https://www.arrow.com/en/products/sc189csktrt/semtech; DESCRIPTION: Conv DC-DC 2.9V to 5.5V Synchronous Step Down Single-Out 1.2V 1.5A 6-Pin MLPD-UT T/R; HEIGHT: 1.45mm; MANUFACTURER_NAME: SEMTECH; MANUFACTURER_PART_NUMBER: SC189CSKTRT; MOUSER_PART_NUMBER: 947-SC189CSKTRT; MOUSER_PRICE-STOCK: https://www.mouser.co.uk/ProductDetail/Semtech/SC189CSKTRT?qs=rBWM4%252BvDhIcKNVCFfiXT%2Fw%3D%3D
IC10 = ISL9301IRZ:ISL9301IRZ: Single Cell Battery Chargers High Input Voltage Charger With Power Path Management Source: Datasheet <https://datasheet.datasheetarchive.com/originals/distributors/Datasheets_SAMA/8ee6ffd80aab1362f5779d2227ba3f4c.pdf>; DESCRIPTION: Single Cell Battery Chargers High Input Voltage Charger With Power Path Management; HEIGHT: 0.9mm; MANUFACTURER_NAME: Renesas Electronics; MANUFACTURER_PART_NUMBER: ISL9301IRZ; MOUSER_PART_NUMBER: 968-ISL9301IRZ; MOUSER_PRICE-STOCK: https://www.mouser.co.uk/ProductDetail/Renesas-Intersil/ISL9301IRZ?qs=dAsayXGOMrsk0CGNaNgRhw%3D%3D
IC11 = PCA9536DP_118:PCA9536DP,118: 4-bit I2C-bus and SMBus I/O port Source: Datasheet <http://www.nxp.com/docs/en/data-sheet/PCA9536.pdf>; ARROW_PART_NUMBER: PCA9536DP,118; ARROW_PRICE-STOCK: https://www.arrow.com/en/products/pca9536dp118/nxp-semiconductors?region=nac; DESCRIPTION: 4-bit I2C-bus and SMBus I/O port; HEIGHT: 1.1mm; MANUFACTURER_NAME: NXP; MANUFACTURER_PART_NUMBER: PCA9536DP,118; MOUSER_PART_NUMBER: 771-PCA9536DP-T; MOUSER_PRICE-STOCK: https://www.mouser.co.uk/ProductDetail/NXP-Semiconductors/PCA9536DP118?qs=LOCUfHb8d9ubAwWIgMOyZQ%3D%3D
IC12 = INA219AIDCNT:INA219AIDCNT: 26-V, Bidirectional, Zero-Drift, High-Side, I2C Out Current/Power Monitor Source: Datasheet <http://www.ti.com/lit/gpn/ina219>; ARROW_PART_NUMBER: INA219AIDCNT; ARROW_PRICE-STOCK: https://www.arrow.com/en/products/ina219aidcnt/texas-instruments?region=nac; DESCRIPTION: 26-V, Bidirectional, Zero-Drift, High-Side, I2C Out Current/Power Monitor; HEIGHT: 1.45mm; MANUFACTURER_NAME: Texas Instruments; MANUFACTURER_PART_NUMBER: INA219AIDCNT; MOUSER_PART_NUMBER: 595-INA219AIDCNT; MOUSER_PRICE-STOCK: https://www.mouser.co.uk/ProductDetail/Texas-Instruments/INA219AIDCNT?qs=NNt36bEIu0sKLmMeh9D0sg%3D%3D
J2 = USB4110-GF-A_REVB:USB4110-GF-A_REVB: Check availability <https://pricing.snapeda.com/parts/USB4110-GF-A/GCT/view-part?ref=eda>; AVAILABILITY: In Stock; DESCRIPTION: USB-C (USB TYPE-C) USB 2.0 Receptacle Connector 24 (16+8 Dummy) Position Surface Mount, Right Angle; Through Hole; MF: GCT; MP: USB4110-GF-A; PACKAGE: None; PRICE: None; PURCHASE-URL: https://pricing.snapeda.com/search/part/USB4110-GF-A/?ref=eda
JP1 = pinhead:PINHD-1X5: PIN HEADER
JP2-JP5 = SparkFun-Jumpers:JUMPER-SMT_2_NO: Normally open jumper This jumper has two pads in close proximity to each other. Apply solder to close the connection. Round pads are easier to solder for beginners, but are a lot larger. SparkFun Product that uses the round pads: SparkFun EL Sequencer <https://www.sparkfun.com/products/12781>
L1 L2 = rcl:L-EU: INDUCTOR, European symbol; SPICEPREFIX: L
Q1 = Crystals-new:CRYSTALRESONATOR
Q2 = IRLTS6342TRPBF:IRLTS6342TRPBF: IRLTS6342TRPBF N-Channel MOSFET, 8.3 A, 30 V HEXFET, 6-Pin TSOP Infineon Source: Datasheet <https://www.infineon.com/dgdl/irlts6342pbf.pdf?fileId=5546d462533600a401535671f35a271a>; ARROW_PART_NUMBER: IRLTS6342TRPBF; ARROW_PRICE-STOCK: https://www.arrow.com/en/products/irlts6342trpbf/infineon-technologies-ag?region=nac; DESCRIPTION: IRLTS6342TRPBF N-Channel MOSFET, 8.3 A, 30 V HEXFET, 6-Pin TSOP Infineon; HEIGHT: 1.45mm; MANUFACTURER_NAME: Infineon; MANUFACTURER_PART_NUMBER: IRLTS6342TRPBF; MOUSER_PART_NUMBER: 942-IRLTS6342TRPBF; MOUSER_PRICE-STOCK: https://www.mouser.co.uk/ProductDetail/Infineon-Technologies/IRLTS6342TRPBF?qs=8jYDHybYAxsDJhh9ct3B2Q%3D%3D
R1-R4 R8 R12 R16 = SparkFun-Resistors:1KOHM: 1kΩ resistor A resistor is a passive two-terminal electrical component that implements electrical resistance as a circuit element. Resistors act to reduce current flow, and, at the same time, act to lower voltage levels within circuits. - Wikipedia; PROD_ID: RES-07856
R5 R6 R9-R11 R13 R15 = SparkFun-Resistors:0OHM: 0Ω resistor A resistor is a passive two-terminal electrical component that implements electrical resistance as a circuit element. Resistors act to reduce current flow, and, at the same time, act to lower voltage levels within circuits. - Wikipedia; PROD_ID: RES-08609
R7 R14 R19-R31 = SparkFun-Resistors:RESISTOR: Generic Resistor Package
RN1-RN28 = resistor-dil:4R-N: Array Chip Resistor Source: RS Component / Phycomp; OC_FARNELL: unknown; OC_NEWARK: unknown
S1 = SparkFun-Switches:MOMENTARY-SWITCH-SPST-2: Momentary Switch (Pushbutton) - SPST - Two Circuits Normally-open (NO) SPST momentary switches (buttons, pushbuttons). Schematic symbol includes two switch circuits. Variants SMD-4.6MMX2.8MM - 4.60mm x 2.80mm Tactile Momentary Button Switch - Used on SparkFun SAMD21 Mini Breakout <https://www.sparkfun.com/products/13664> SMD-5.2MM - Mini Pushbutton Switch - SMD <https://www.sparkfun.com/products/8720> - Used on Arduino Pro Mini <https://www.sparkfun.com/products/11114>; PROD_ID: SWCH-08247; SF_SKU: COM-08720
TP1-TP4 = testpad:TP: Test pad
U1 U3 U7-U12 = LM358PW:LM358PW: Check availability <https://pricing.snapeda.com/parts/LM358PW/Texas%20Instruments/view-part?ref=eda>; AVAILABILITY: In Stock; DESCRIPTION: Dual, 30-V, 700-kHz operational amplifier; MF: Texas Instruments; MP: LM358PW; PACKAGE: TSSOP-8 Texas Instruments; PRICE: None; PURCHASE-URL: https://pricing.snapeda.com/search/part/LM358PW/?ref=eda
U4 = SparkFun-IC-Memory:SPI_FLASH-X25XX: 32M Serial Flash Memory 8pin SPI Flash series x25xx. Works with devices like W25X32 and BR25L32 Datasheet <http://www.macronix.com/Lists/Datasheet/Attachments/5031/MX25L3206E,%203V,%2032Mb,%20v1.5.pdf> SparkFun Products SparkFun Venus GPS Logger <https://www.sparkfun.com/products/10920> (GPS-10920); PROD_ID: IC-09109
U5 U6 U14 = LP2985AIM5-2.5:LP2985AIM5-2.5: Check prices <https://pricing.snapeda.com/parts/LP2985AIM5-2.5/NOPB/Texas%20Instruments/view-part?ref=eda>; AVAILABILITY: In Stock; DESCRIPTION: 150-mA, 16-V, low-dropout voltage regulator with enable 5-SOT-23 -40 to 125; MF: Texas Instruments; MP: LP2985AIM5-2.5/NOPB; PACKAGE: SOT-23-5 Texas Instruments; PRICE: None; PURCHASE-URL: https://pricing.snapeda.com/search/part/LP2985AIM5-2.5/NOPB/?ref=eda
U13 = FT232HL-REEL:FT232HL-REEL: Ic, Interface; Usb Hi-Speed To Uart/Fifo/Spi/Jtag, I2c; 1.8v-5.25v; 25ma; Lqfp-48 Check availability <https://pricing.snapeda.com/parts/FT232HL/FTDI%2C%20Future/view-part?ref=eda>; AVAILABILITY: In Stock; DESCRIPTION: USB Bridge, USB to UART,FIFO USB 2.0 UART, FIFO Interface 48-LQFP (7x7); MF: FTDI, Future; MP: FT232HL; PACKAGE: LQFP-48 FTDI; PRICE: None; PURCHASE-URL: https://pricing.snapeda.com/search/part/FT232HL/?ref=eda
U15 = ICM-42605:ICM-42605: Single-Interface MotionTracking device The ICM-42605 is a 6-axis MotionTracking device that combines a 3-axis gyroscope, and a 3-axis accelerometer in a small 2.5x3x0.91 mm (14-pin LGA) package. It also features a 2K-byte FIFO that can lower the traffic on the serial bus interface, and reduce power consumption by allowing the system processor to burst read sensor data and then go into a low-power mode. Check prices <https://pricing.snapeda.com/parts/ICM-42605/TDK%20InvenSense/view-part?ref=eda>; AVAILABILITY: Warning; DESCRIPTION: Accelerometer, Gyroscope, 6 Axis Sensor I²C, I3C℠, SPI Output; MF: TDK InvenSense; MP: ICM-42605; PACKAGE: - TDK InvenSense; PRICE: None; PURCHASE-URL: https://pricing.snapeda.com/search/part/ICM-42605/?ref=eda
U16 = WS2812-2020:WS2812-2020: Check availability <https://pricing.snapeda.com/parts/WS2812-2020/Worldsemi/view-part?ref=eda>; AVAILABILITY: Not in stock; DESCRIPTION: Intelligent control LED light source, SMD-4; MF: Worldsemi; MP: WS2812-2020; PACKAGE: Package; PRICE: None
U22 = LM2735XMF:LM2735XMF: Check prices <https://pricing.snapeda.com/parts/LM2735XMF/NOPB/Texas%20Instruments/view-part?ref=eda>; AVAILABILITY: In Stock; DESCRIPTION: 520kHz/1.6MHz space efficient boost and SEPIC DC-DC regulator 5-SOT-23 -40 to 125; MF: Texas Instruments; MP: LM2735XMF/NOPB; PACKAGE: SOT-23-5 Texas Instruments; PRICE: None; PURCHASE-URL: https://pricing.snapeda.com/search/part/LM2735XMF/NOPB/?ref=eda
U$1-U$8 U$10-U$36 = MYCONN:PAD
U$9 = nrf24modules:NRF24MODULE
Y2 = CSTCE8M00G52A-R0:CSTCE8M00G52A-R0: 8MHz Ceramic Resonator Built in Capacitor 10pF +/- 0.2% -40C - 125C Surface Mount Check availability <https://pricing.snapeda.com/parts/CSTCE8M00G52A-R0./Murata%20Electronics/view-part?ref=eda>; AVAILABILITY: Not in stock; DESCRIPTION: RESONATOR, CERAMIC, 8MHZ, SMD; Frequency:8MHz; Oscillator Mounting:SMD; No. of Pins:3 Pin; Resonant Impedance:40ohm; Frequency Tolerance:± 0.5%; Product Range:CERALOCK Series; Frequency Stability:-; Operating Temperature Min:-20°C; Operating Temperature Max:80°C; SVHC:Lead titanium zirconium oxide (15-Jan-2018); Automotive Qualification Standard:AEC-Q200; No. of Pins:3Pins; MF: Murata Electronics; MP: CSTCE8M00G52A-R0.; PACKAGE: None; PRICE: None